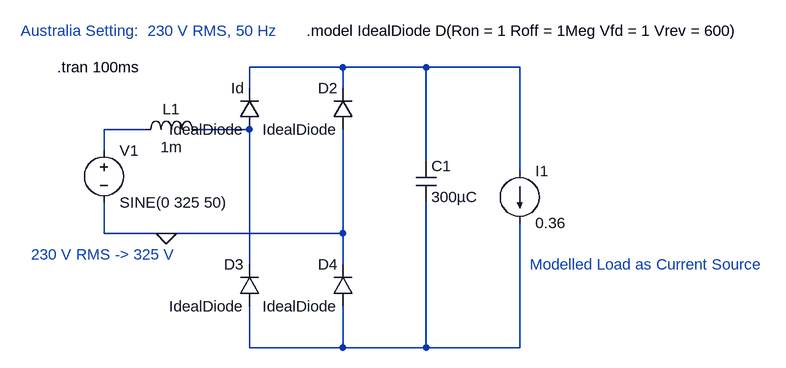
[diagram p0: schematic Australia DBR.asc]
Australia DBR.asc, the LTspice schematic file:
Version 4
SHEET 1 1008 680
WIRE 368 176 224 176
WIRE 496 176 368 176
WIRE 640 176 496 176
WIRE 224 208 224 176
WIRE 368 208 368 176
WIRE 64 272 0 272
WIRE 224 272 144 272
WIRE 0 304 0 272
WIRE 496 320 496 176
WIRE 640 336 640 176
WIRE 0 432 0 384
WIRE 96 432 0 432
WIRE 368 432 368 272
WIRE 368 432 96 432
WIRE 224 480 224 272
WIRE 368 480 368 432
WIRE 224 608 224 544
WIRE 368 608 368 544
WIRE 368 608 224 608
WIRE 496 608 496 384
WIRE 496 608 368 608
WIRE 640 608 640 416
WIRE 640 608 496 608
FLAG 96 432 0
SYMBOL voltage 0 288 R0
SYMATTR InstName V1
SYMATTR Value SINE(0 325 50)
SYMBOL cap 480 320 R0
SYMATTR InstName C1
SYMATTR Value 300µC
SYMBOL current 640 336 R0
SYMATTR InstName I1
SYMATTR Value 0.36
SYMBOL ind 48 288 R270
WINDOW 0 32 56 VTop 2
WINDOW 3 5 56 VBottom 2
SYMATTR InstName L1
SYMATTR Value 1m
SYMBOL diode 240 272 R180
WINDOW 0 24 64 Left 2
WINDOW 3 24 0 Left 2
SYMATTR InstName Id
SYMATTR Value IdealDiode
SYMBOL diode 384 272 R180
WINDOW 0 24 64 Left 2
WINDOW 3 24 0 Left 2
SYMATTR InstName D2
SYMATTR Value IdealDiode
SYMBOL diode 240 544 R180
WINDOW 0 24 64 Left 2
WINDOW 3 24 0 Left 2
SYMATTR InstName D3
SYMATTR Value IdealDiode
SYMBOL diode 384 544 R180
WINDOW 0 24 64 Left 2
WINDOW 3 24 0 Left 2
SYMATTR InstName D4
SYMATTR Value IdealDiode
TEXT -112 464 Left 2 ;230 V RMS -> 325 V
TEXT -72 176 Left 2 !.tran 100ms
TEXT 656 480 Left 2 ;Modelled Load as Current Source
TEXT -128 120 Left 2 ;Australia Setting:  230 V RMS, 50 Hz
TEXT 312 120 Left 2 !.model IdealDiode D(Ron = 1 Roff = 1Meg Vfd = 1 Vrev = 600)

The netlist it stands for:
* Australia DBR.asc
V1 N002 0 SINE(0 325 50)
C1 N001 N004 300µC
I1 N001 N004 0.36
L1 N002 N003 1m
D§Id N003 N001 IdealDiode
D2 0 N001 IdealDiode
D3 N004 N003 IdealDiode
D4 N004 0 IdealDiode
.model D D
.lib standard.dio
* 230 V RMS -> 325 V
.tran 100ms
* Modelled Load as Current Source
* Australia Setting:  230 V RMS, 50 Hz
.model IdealDiode D(Ron = 1 Roff = 1Meg Vfd = 1 Vrev = 600)
.backanno
.end